# EAGLE design Fermento (EAGLE 6.5.0)
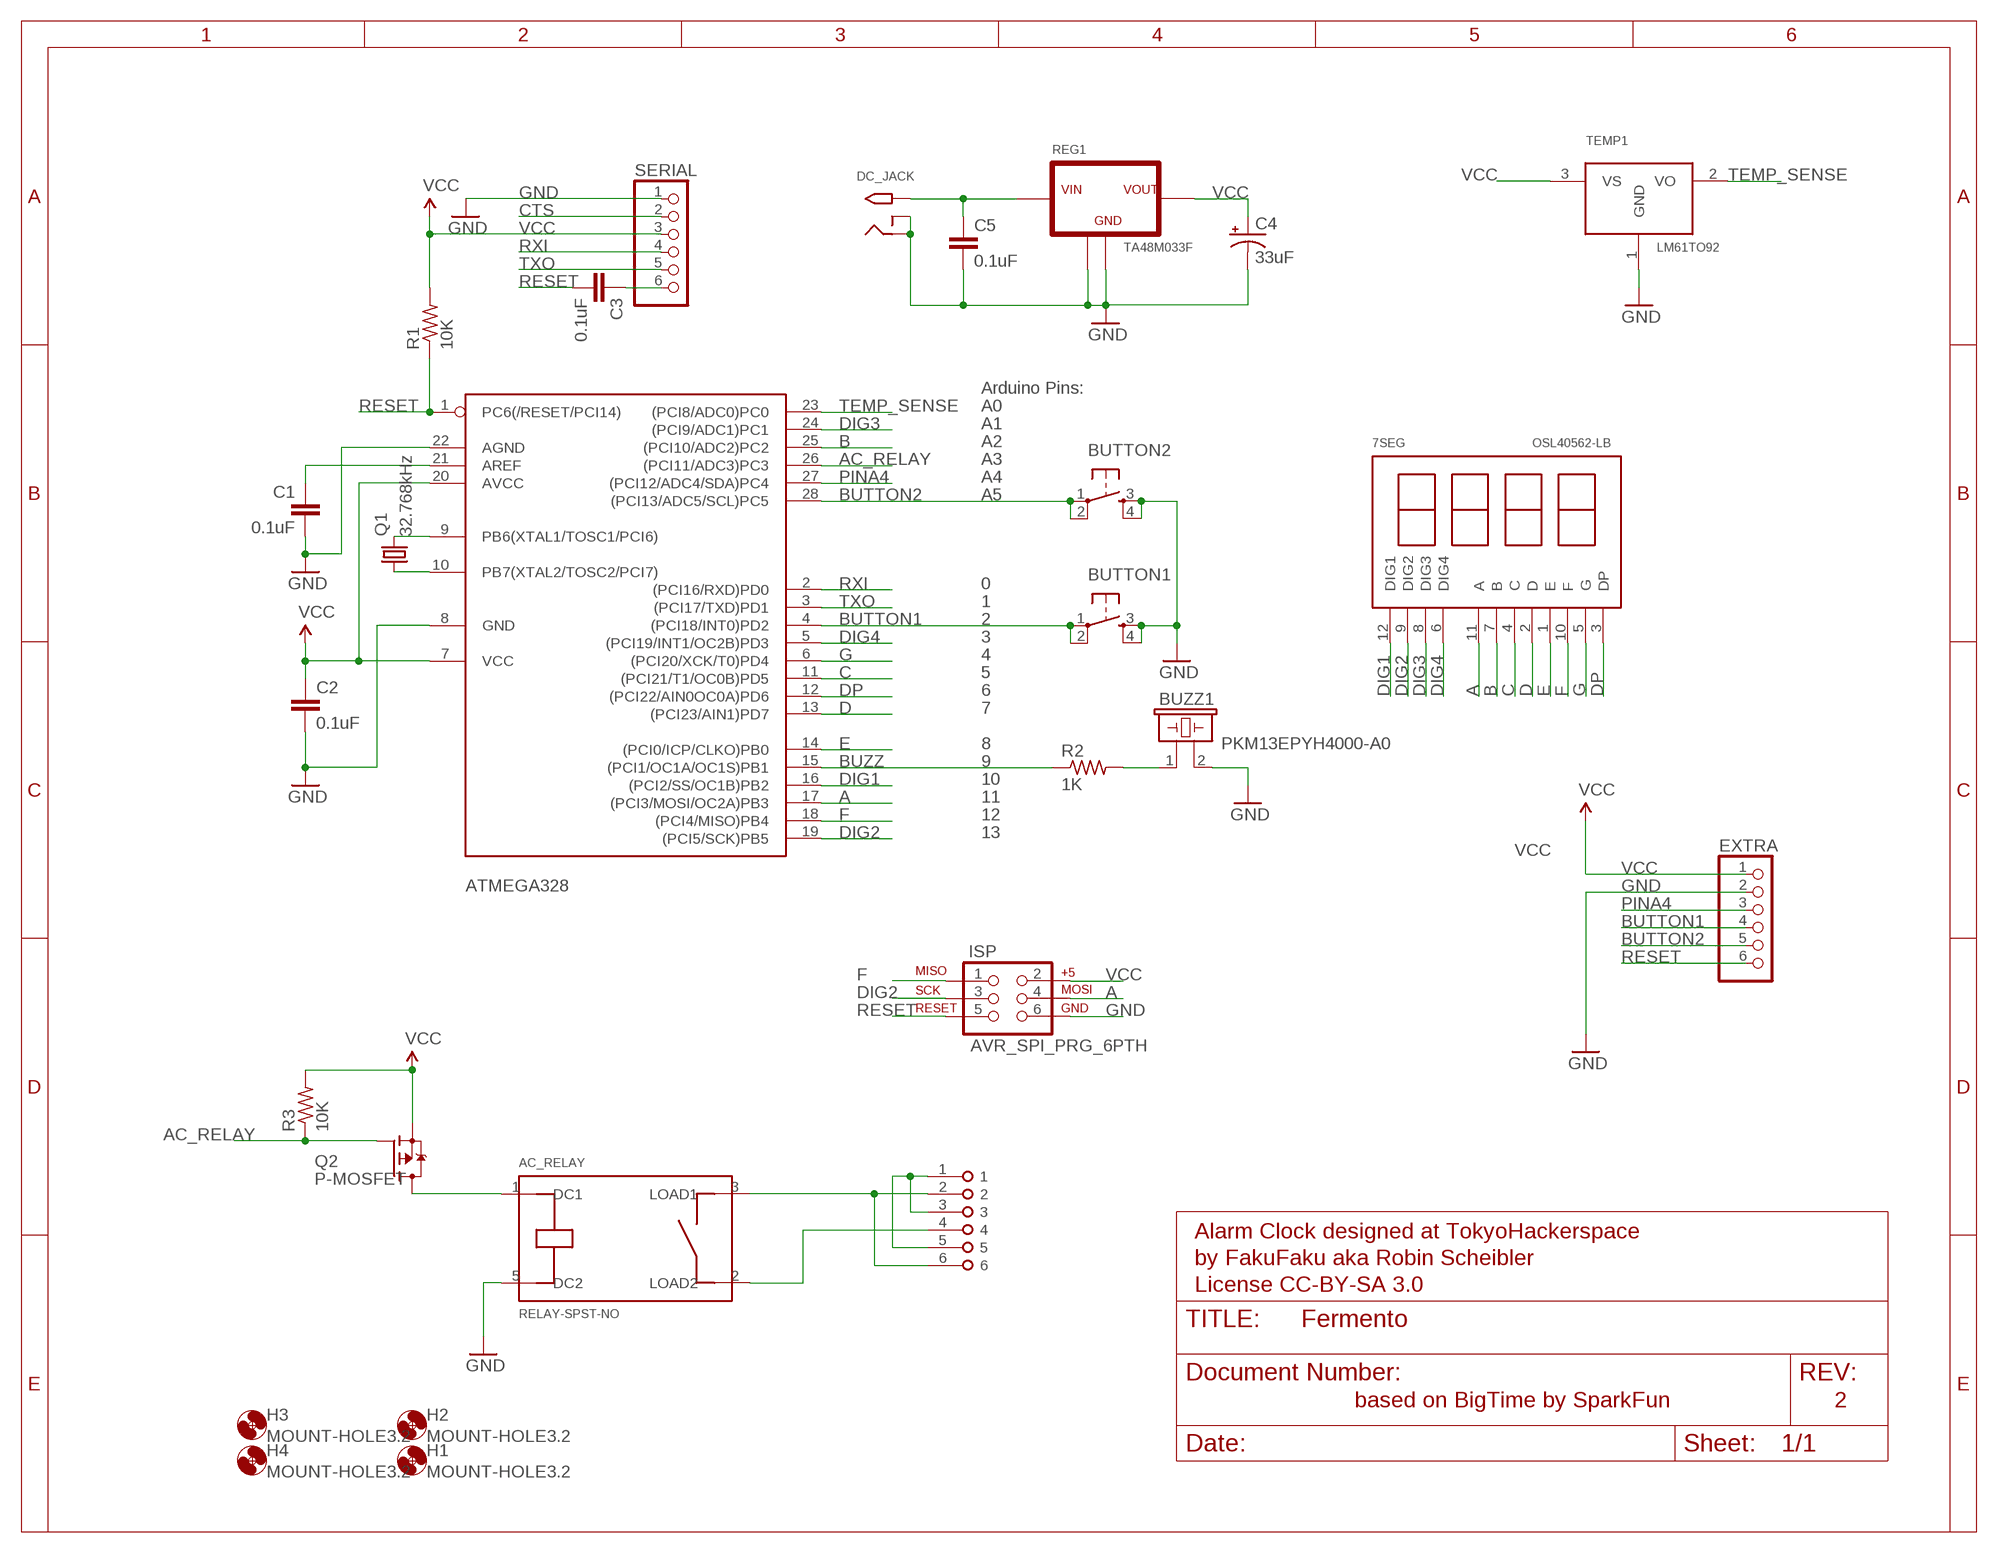
[diagram p0: schematic, sheet 1]

## Parts
7SEG  OSL40562-LB  7SEG  [OSL40562]
AC_RELAY  RELAY-SPST-NO  [G6RL-1A-DC3]
ATMEGA328  ATMEGA168-20P  [DIL28-3]
BUTTON1  TAC_SWITCHPTH  [TACTILE-PTH]
BUTTON2  TAC_SWITCHPTH  [TACTILE-PTH]
BUZZ1  PKM13EPYH4000-A0  BUZZER13MM  [PIEZO-MURATA-13MM]
C1  0.1uF  CAPPTH  [CAP-PTH-SMALL]
C2  0.1uF  CAPPTH  [CAP-PTH-SMALL]
C3  0.1uF  CAPPTH  [CAP-PTH-SMALL]
C4  33uF  CAP_POLPTH2  [CPOL-RADIAL-10UF-25V]
C5  0.1uF  CAPPTH  [CAP-PTH-SMALL]
DC_JACK  2.1MMJACKTHM  [PJ-102A]
EXTRA  PINHD-1X6  [1X06]
H1  MOUNT-HOLE3.2  [3,2]
H2  MOUNT-HOLE3.2  [3,2]
H3  MOUNT-HOLE3.2  [3,2]
H4  MOUNT-HOLE3.2  [3,2]
ISP  AVR_SPI_PRG_6PTH  [2X3]
Q1  32.768kHz  CRYSTAL8X3  [CRYSTAL-8X3-TH]
Q2  P-MOSFET  [TO92-]
R1  10K  R-US_0207/10  [0207/10]
R2  1K  R-US_0207/10  [0207/10]
R3  10K  R-US_0207/10  [0207/10]
REG1  TA48M033F  REGULATOR-TO-220  [TO-220]
SERIAL  PINHD-1X6/90  [1X06/90]
TEMP1  LM61TO92  [TO92-]
U$2  TERMINAL-6  [MBE-156]

## Nets
A: 7SEG.11(A) ATMEGA328.17((PCI3/MOSI/OC2A)PB3) ISP.4
AC_RELAY: ATMEGA328.26((PCI11/ADC3)PC3) Q2.2(G) R3.1
AREF: ATMEGA328.21(AREF) C1.1
B: 7SEG.7(B) ATMEGA328.25((PCI10/ADC2)PC2)
BUTTON1: ATMEGA328.4((PCI18/INT0)PD2) BUTTON1.1 BUTTON1.2 EXTRA.4
BUTTON2: ATMEGA328.28((PCI13/ADC5/SCL)PC5) BUTTON2.1 BUTTON2.2 EXTRA.5
BUZZ: ATMEGA328.15((PCI1/OC1A/OC1S)PB1) R2.1
C: 7SEG.4(C) ATMEGA328.11((PCI21/T1/OC0B)PD5)
CTS: SERIAL.2
D: 7SEG.2(D) ATMEGA328.13((PCI23/AIN1)PD7)
DIG1: 7SEG.12(DIG1) ATMEGA328.16((PCI2/SS/OC1B)PB2)
DIG2: 7SEG.9(DIG2) ATMEGA328.19((PCI5/SCK)PB5) ISP.3
DIG3: 7SEG.8(DIG3) ATMEGA328.24((PCI9/ADC1)PC1)
DIG4: 7SEG.6(DIG4) ATMEGA328.5((PCI19/INT1/OC2B)PD3)
DP: 7SEG.3(DP) ATMEGA328.12((PCI22/AIN0OC0A)PD6)
E: 7SEG.1(E) ATMEGA328.14((PCI0/ICP/CLKO)PB0)
F: 7SEG.10(F) ATMEGA328.18((PCI4/MISO)PB4) ISP.1
G: 7SEG.5(G) ATMEGA328.6((PCI20/XCK/T0)PD4)
GND: AC_RELAY.5(DC2) ATMEGA328.8(GND) ATMEGA328.22(AGND) BUTTON1.3 BUTTON1.4 BUTTON2.3 BUTTON2.4 BUZZ1.2 C1.2 C2.2 C4.2(-) C5.2 DC_JACK.RING DC_JACK.RING_SW EXTRA.2 ISP.6 REG1.CENTER(GND) REG1.THERMAL(GND) SERIAL.1 TEMP1.1(GND)
N$1: ATMEGA328.9(PB6(XTAL1/TOSC1/PCI6)) Q1.2
N$2: ATMEGA328.10(PB7(XTAL2/TOSC2/PCI7)) Q1.1
N$3: C5.1 DC_JACK.TIP REG1.LEFT(VIN)
N$5: U$2.1 U$2.3 U$2.5
N$6: AC_RELAY.3(LOAD1) U$2.2 U$2.6
N$7: C3.1 SERIAL.6
N$8: AC_RELAY.2(LOAD2) U$2.4
N$13: BUZZ1.1 R2.2
PINA4: ATMEGA328.27((PCI12/ADC4/SDA)PC4) EXTRA.3
RELAY: AC_RELAY.1(DC1) Q2.1(D)
RESET: ATMEGA328.1(PC6(/RESET/PCI14)) C3.2 EXTRA.6 ISP.5 R1.1
RXI: ATMEGA328.2((PCI16/RXD)PD0) SERIAL.4
TEMP_SENSE: ATMEGA328.23((PCI8/ADC0)PC0) TEMP1.2(VO)
TXO: ATMEGA328.3((PCI17/TXD)PD1) SERIAL.5
VCC: ATMEGA328.7(VCC) ATMEGA328.20(AVCC) C2.1 C4.1(+) EXTRA.1 ISP.2 Q2.3(S) R1.2 R3.2 REG1.RIGHT(VOUT) SERIAL.3 TEMP1.3(VS)

## Notes on the sheet
- Arduino Pins:
- A0
- A1
- A2
- A3
- A4
- A5
- 0
- 1
- 2
- 3
- 4
- 5
- 6
- 7
- 8
- 9
- 10
- 11
- 12
- 13
- Alarm Clock designed at TokyoHackerspace
- by FakuFaku aka Robin Scheibler
- License CC-BY-SA 3.0
- based on BigTime by SparkFun | 2

## Library data of the parts
7SEG = Robin:7SEG
AC_RELAY = Robin:RELAY-SPST-NO
ATMEGA328 = adafruit:ATMEGA168*P: MICROCONTROLLER 16 kBytes FLASH 1 kBytes SRAM 512 Bytes EEPROM USART 8-channel 10 bit ADC
BUTTON1 BUTTON2 = SparkFun:TAC_SWITCH: Momentary Switch Button commonly used for reset or general input. Spark Fun Electronics SKU : COM-00097
BUZZ1 = Robin:BUZZER: BUZZER Source: muRata
C1-C3 C5 = SparkFun:CAP: Capacitor Standard 0603 ceramic capacitor, and 0.1" leaded capacitor.
C4 = SparkFun:CAP_POL: Capacitor Polarized These are standard SMD and PTH capacitors. Normally 10uF, 47uF, and 100uF in electrolytic and tantalum varieties. Always verify the external diameter of the through hole cap, it varies with capacity, voltage, and manufacturer. The EIA devices should be standard.
DC_JACK = adafruit:2.1MMJACK: 2.1mm x 5.5mm THM DC jack with internal switch. Digikey part #PJ-102A, 4UCON part #05537 2.1mm x 5.5mm SMT DC jack with internal switch. Digikey part #PJ-002A-SMT, 4UCON part #03267 By microbuilder.eu & adafruit.com
EXTRA SERIAL = pinhead:PINHD-1X6: PIN HEADER
H1-H4 = holes:MOUNT-HOLE: MOUNTING HOLE with drill center marker
ISP = SparkFun:AVR_SPI_PRG_6: AVR ISP 6 Pin This is the reduced ISP connector for AVR programming. Common on Arduino. This footprint will take up less PCB space and can be used with a 10-pin to 6-pin adapter such as SKU: BOB-08508
Q1 = Robin:CRYSTAL
Q2 = Robin:P-MOSFET
R1-R3 = adafruit:R-US_: RESISTOR, American symbol
REG1 = Robin:REGULATOR
TEMP1 = Robin:LM61: The LM61 is a precision integrated-circuit temperature sensor that can sense a ?30°C to +100°C temperature range while operating from a single +2.7V supply. The LM61's output volt- age is linearly proportional to Celsius (Centigrade) tempera- ture (+10 mV/°C) and has a DC offset of +600 mV. The offset allows reading negative temperatures without the need for a negative supply. The nominal output voltage of the LM61 ranges from +300 mV to +1600 mV for a ?30°C to +100°C temperature range. The LM61 is calibrated to provide accu- racies of ±2.0°C at room temperature and ±3°C over the full ?25°C to +85°C temperature range.
U$2 = Robin:TERMINAL-6

## Board
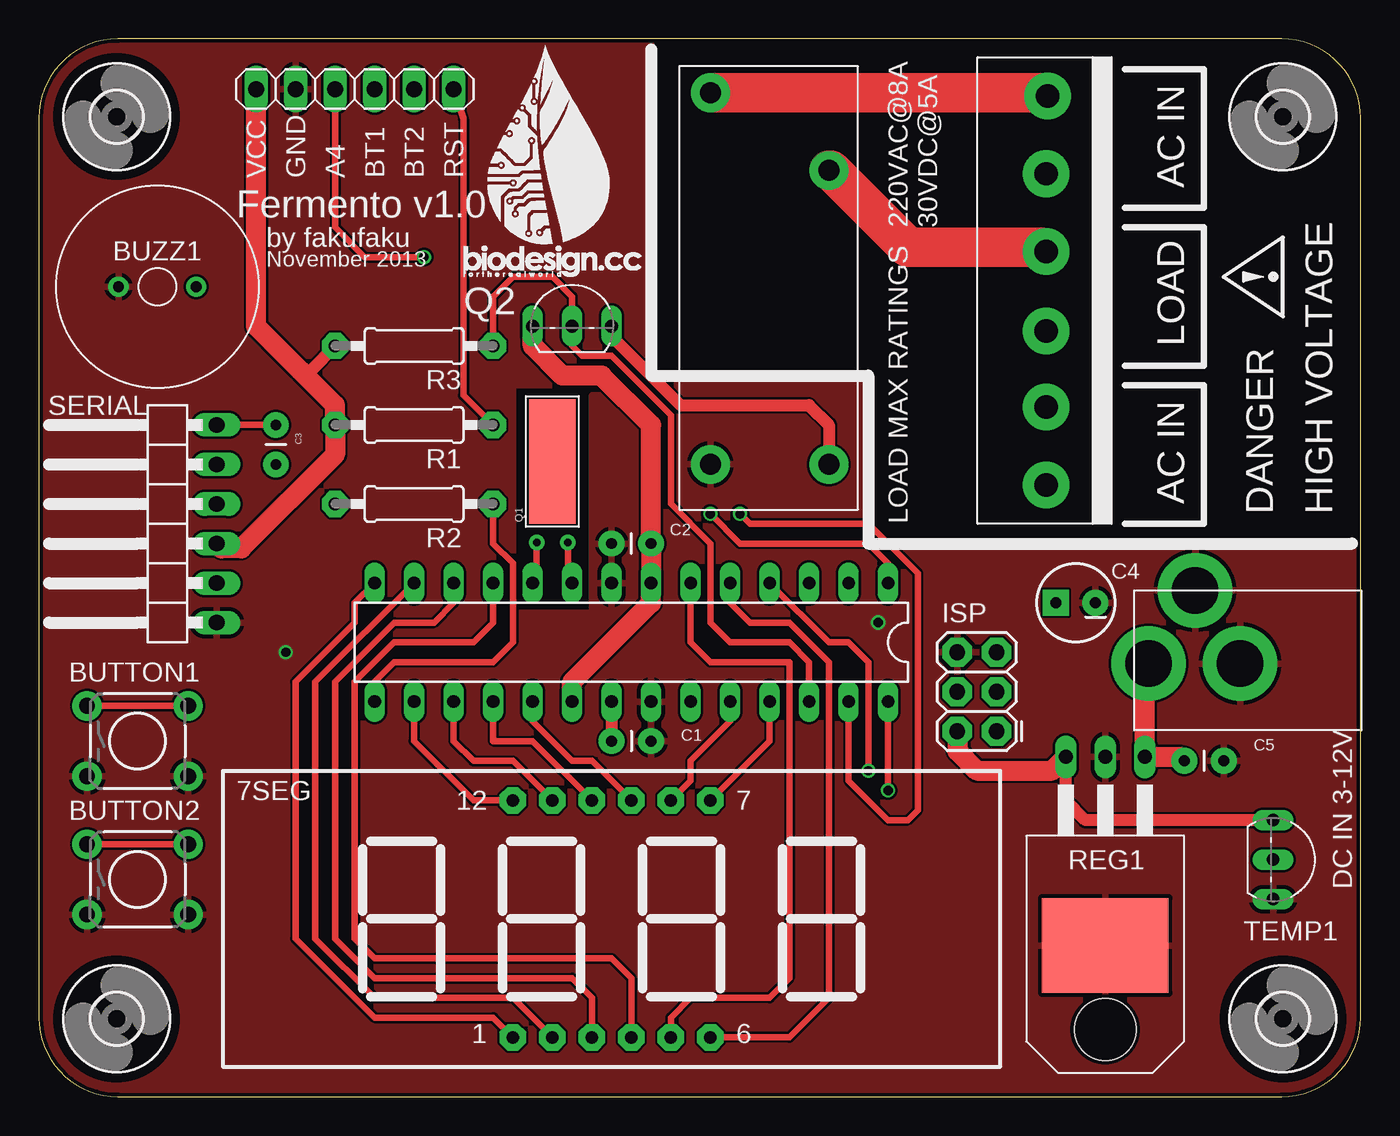
[diagram p1: board, top side]
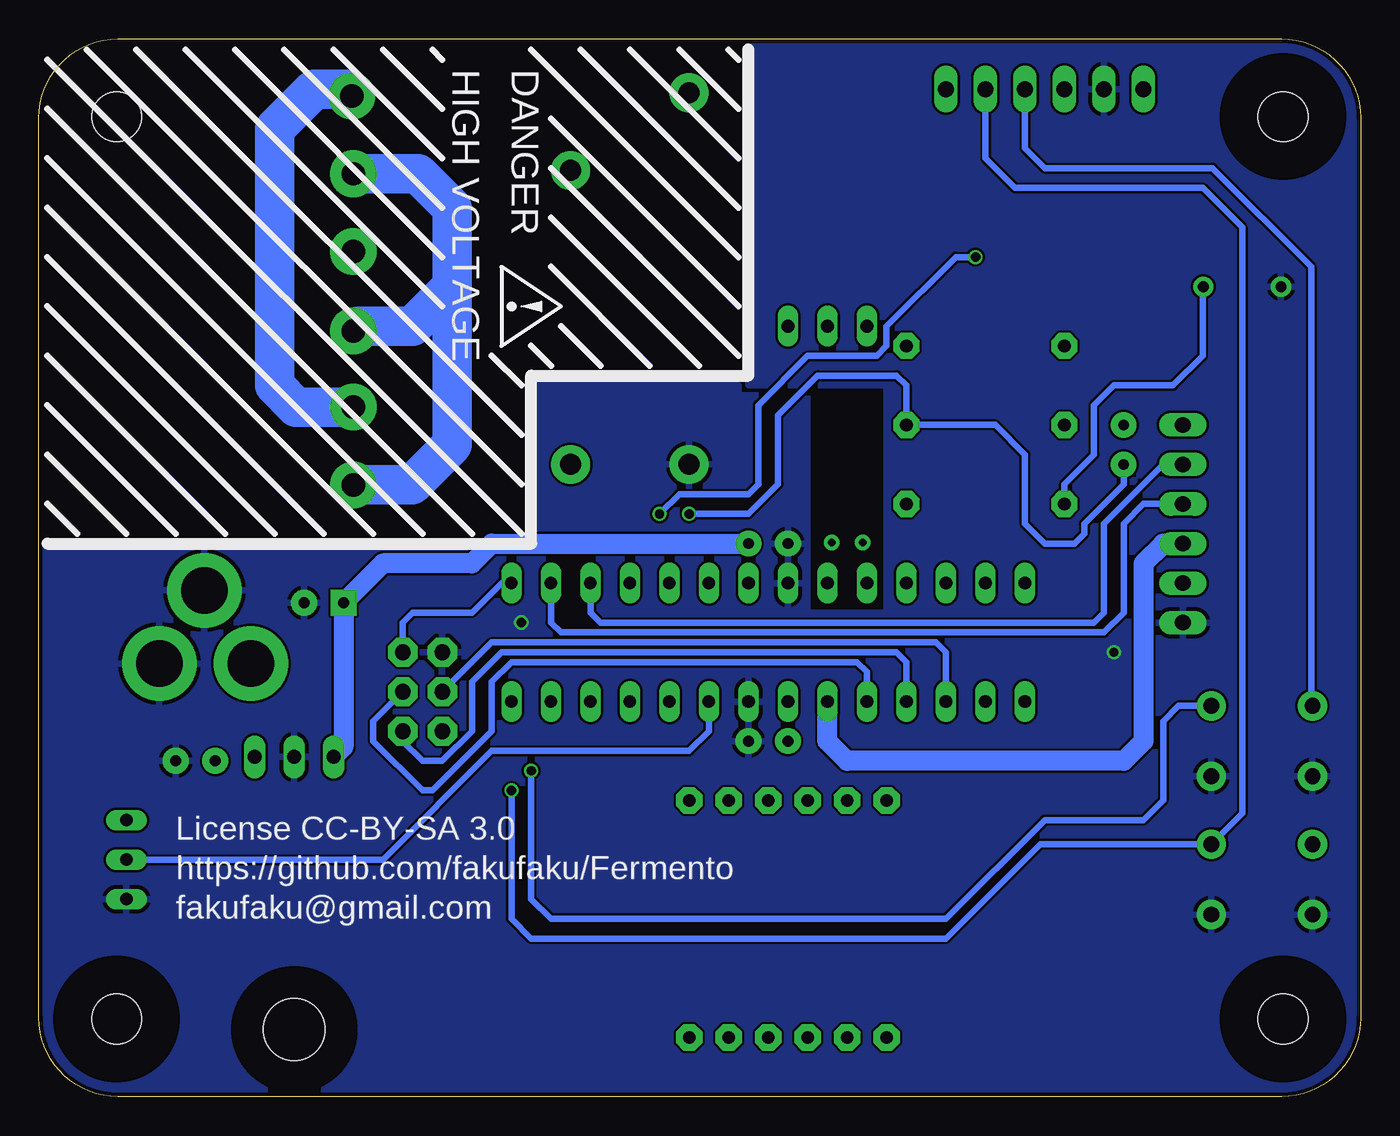
[diagram p2: board, bottom side, seen from below]

Size 85 x 68 mm. Coordinates in mm from the lower left corner, seen from the top.
Outline: 0,62.92 0,5.08 arc90 5.08,0 79.92,0 arc90 85,5.08 85,62.92 arc90 79.92,68 5.08,68 arc90 0,62.92
Copper layers (1*16): Top 0.035mm / dielectric 1.5mm / Bottom 0.035mm
Design rules "Fusion_eagle_rule_v1.1": minimum track width 6mil, minimum drill 12mil, track to track 6mil, track to pad 6mil, pad to pad 6mil, via to via 6mil, smd to smd 0mil, copper to edge 10mil, drill to drill 10mil, minimum pad ring 10mil, minimum via ring 6mil, stop-mask expansion 2mil, vias tented up to drill 100mil, thermal gap 10mil

### Footprints (pad centres in the part's own frame; a part is rotated, then mirrored left to right if it is on the bottom)
OSL40562 = drill 0.8 pad 1.7 octagon: 1 -6.35,-7.62; 2 -3.81,-7.62; 3 -1.27,-7.62; 4 1.27,-7.62; 5 3.81,-7.62; 6 6.35,-7.62; 7 6.35,7.62; 8 3.81,7.62; 9 1.27,7.62; 10 -1.27,7.62; 11 -3.81,7.62; 12 -6.35,7.62
G6RL-1A-DC3 = drill 1.35 pad 2.5: 1 0,-7.62; 2 18.9,-7.62; 3 23.9,0; 5 0,0
DIL28-3 = drill 0.813 long: 1 -16.51,-3.81; 2 -13.97,-3.81; 3 -11.43,-3.81; 4 -8.89,-3.81; 5 -6.35,-3.81; 6 -3.81,-3.81; 7 -1.27,-3.81; 8 1.27,-3.81; 9 3.81,-3.81; 10 6.35,-3.81; 11 8.89,-3.81; 12 11.43,-3.81; 13 13.97,-3.81; 14 16.51,-3.81; 15 16.51,3.81; 16 13.97,3.81; 17 11.43,3.81; 18 8.89,3.81; 19 6.35,3.81; 20 3.81,3.81; 21 1.27,3.81; 22 -1.27,3.81; 23 -3.81,3.81; 24 -6.35,3.81; 25 -8.89,3.81; 26 -11.43,3.81; 27 -13.97,3.81; 28 -16.51,3.81
TACTILE-PTH = drill 1.016 pad 1.88: 1 -3.251,2.261; 2 3.251,2.261; 3 -3.251,-2.261; 4 3.251,-2.261
PIEZO-MURATA-13MM = drill 0.7 pad 1.3: 1 -2.5,0; 2 2.5,0
CAP-PTH-SMALL = drill 0.7 pad 1.651: 1 0,0; 2 2.54,0
CPOL-RADIAL-10UF-25V = drill 0.7 pad 1.651 square: 1 1.27,0 | drill 0.7 pad 1.651: 2 -1.27,0
PJ-102A = drill 3 pad 4.8: RING 0.1,-3.39; RING_SW -4.6,-6.29; TIP 0.1,-9.29
1X06 = drill 1.016 long: 1 -6.35,0; 2 -3.81,0; 3 -1.27,0; 4 1.27,0; 5 3.81,0; 6 6.35,0
3,2 = hole 3.2: 0,0
2X3 = drill 1.016 pad 1.88 octagon: 1 0,0; 2 0,2.54; 3 2.54,0; 4 2.54,2.54; 5 5.08,0; 6 5.08,2.54
CRYSTAL-8X3-TH = drill 0.5 pad 0.8: 1 -1,-1.2; 2 1,-1.2 | smd 3 x 8: PLATE 0,4
TO92- = drill 0.813 long: 1 2.54,0; 2 0,0; 3 -2.54,0
0207/10 = drill 0.813 pad 1.676 octagon: 1 -5.08,0; 2 5.08,0
TO-220 = drill 0.889 long: CENTER 5.08,-5.08; LEFT 2.54,-5.08; RIGHT 7.62,-5.08 | smd 8.128 x 6.096: THERMAL 5.08,7.048 | hole 3.962: 5.08,12.446
1X06/90 = drill 1.016 long: 1 -6.35,-3.81; 2 -3.81,-3.81; 3 -1.27,-3.81; 4 1.27,-3.81; 5 3.81,-3.81; 6 6.35,-3.81
MBE-156 = drill 1.5 pad 3: 1 2.5,0; 2 7.5,0; 3 12.4,0; 4 17.5,0; 5 22.5,0; 6 27.5,-0.1

### Placement (x,y rotation side)
7SEG  36.83,11.43 0 top
AC_RELAY  43.18,40.64 90 top
ATMEGA328  38.1,29.21 180 top
BUTTON1  6.35,22.86 0 top
BUTTON2  6.35,13.97 0 top
BUZZ1  7.62,52.07 180 top
C1  36.83,22.86 0 top
C2  39.37,35.56 180 top
C3  15.24,43.18 270 top
C4  66.67,31.75 180 top
C5  73.66,21.59 0 top
DC_JACK  80.64,27.94 270 top
EXTRA  20.32,64.77 0 top
H1  5,63 0 top
H2  80,63 0 top
H3  80,5 0 top
H4  5,5 0 top
ISP  61.59,23.5 90 top
Q1  33.02,36.83 0 top
Q2  34.29,49.53 0 top
R1  24.13,43.18 180 top
R2  24.13,38.1 180 top
R3  24.13,48.26 180 top
REG1  73.66,16.76 180 top
SERIAL  7.62,36.83 90 top
TEMP1  79.38,15.24 270 top
U$1  [DANGER-SMALL]  78.74,52.7 90 top
U$2  64.77,36.83 90 top
U$3  [DANGER-SMALL]  53.98,50.8 270 bottom
U$4  [BIODESIGN-LOGO]  27.3,52.7 0 top

### Tracks (layer width: path | path; a pad name or v marks a point on that pad's centre or on a via)
A
  Top 0.406: ATMEGA328.17 26.67,22.86 27.94,21.59 30.48,21.59 7SEG.11
  Bottom 0.406: ATMEGA328.17 26.67,28.57 27.3,29.21 55.88,29.21 ISP.4
AC_RELAY
  Top 0.406: ATMEGA328.26 49.53,27.94 48.26,29.21 44.45,29.21 43.18,30.48 43.18,35.56 40.64,38.1 40.64,43.81 36.83,47.62 34.92,47.62 34.29,48.26 Q2.2 34.29,51.44 33.02,52.7 30.48,52.7 29.21,51.44 R3.1
AREF
  Top 0.762: ATMEGA328.21 C1.1
B
  Top 0.406: ATMEGA328.25 46.99,22.86 7SEG.7
BUTTON1  (via drill 0.6)
  Top 0.406: BUTTON1.1 BUTTON1.2 | ATMEGA328.4 50.8,29.21 52.07,29.21 53.34,27.94 v53.34,20.95
  Bottom 0.406: BUTTON1.2 11.71,25.12 12.7,24.13 12.7,19.05 13.97,17.78 20.32,17.78 26.67,11.43 52.07,11.43 53.34,12.7 v53.34,20.95 | EXTRA.4 21.59,60.96 20.32,59.69 9.53,59.69 3.17,53.34 3.17,25.2 BUTTON1.1
BUTTON2  (via drill 0.6)
  Top 0.406: BUTTON2.1 BUTTON2.2 | v54.61,19.68 ATMEGA328.28
  Bottom 0.406: v54.61,19.68 54.61,11.43 53.34,10.16 26.67,10.16 20.6,16.23 BUTTON2.2 7.62,18.21 7.62,55.88 10.16,58.42 22.23,58.42 24.13,60.33 EXTRA.5
BUZZ
  Top 0.406: R2.1 29.21,35.56 30.48,34.29 30.48,29.21 29.21,27.94 22.86,27.94 21.59,26.67 ATMEGA328.15
C
  Top 0.406: 7SEG.4 38.1,7.62 36.83,8.89 21.59,8.89 20.32,10.16 20.32,26.67 22.86,29.21 27.94,29.21 29.21,30.48 ATMEGA328.11
D
  Top 0.406: ATMEGA328.13 17.78,26.67 17.78,10.16 21.59,6.35 30.48,6.35 7SEG.2
DIG1
  Top 0.406: ATMEGA328.16 24.13,22.86 27.94,19.05 7SEG.12
DIG2
  Top 0.406: ATMEGA328.19 31.75,24.13 34.29,21.59 35.56,21.59 7SEG.9
  Bottom 0.406: ISP.3 63.5,24.13 63.5,22.86 60.33,19.68 59.69,19.68 55.88,23.5 55.88,26.67 54.61,27.94 32.38,27.94 31.75,27.3 ATMEGA328.19
DIG3
  Top 0.406: ATMEGA328.24 44.45,24.13 41.91,21.59 41.91,20.32 7SEG.8
DIG4
  Top 0.406: 7SEG.6 48.26,3.81 50.8,6.35 50.8,27.94 48.26,30.48 45.72,30.48 44.45,31.75 ATMEGA328.5
DP
  Top 0.406: 7SEG.3 35.56,6.35 34.29,7.62 21.59,7.62 19.05,10.16 19.05,26.67 22.86,30.48 25.4,30.48 26.67,31.75 ATMEGA328.12
E
  Top 0.406: ATMEGA328.14 20.32,31.75 20.32,30.48 16.51,26.67 16.51,10.16 21.59,5.08 29.21,5.08 7SEG.1
F
  Top 0.406: ATMEGA328.18 29.21,22.86 31.75,22.86 7SEG.10
  Bottom 0.406: ISP.1 61.59,22.86 60.33,21.59 59.05,21.59 57.15,23.5 57.15,26.67 55.24,28.57 29.84,28.57 29.21,27.94 ATMEGA328.18
G
  Top 0.406: 41.91,31.75 ATMEGA328.6 41.91,29.21 43.18,27.94 48.26,27.94 48.26,7.62 46.99,6.35 41.91,6.35 40.64,5.08 7SEG.5
GND  (via drill 0.6)
  other vias: 15.88,28.57 53.98,30.48
  pour Bottom: 39.37,73.66 -1.27,73.66 -1.27,-1.27 88.9,-1.27 88.9,35.56 53.34,35.56 53.34,45.72 40.01,45.72 40.01,45.09 35.56,45.09 35.56,31.11 30.48,31.11 30.48,45.72 39.37,45.72
  pour Top: -2.54,-1.27 -2.54,69.85 39.37,69.85 39.37,45.72 30.48,45.72 30.48,31.11 35.56,31.11 35.56,45.09 40.01,45.09 40.01,45.72 53.34,45.72 53.34,35.56 86.36,35.56 86.36,-1.27
N$1
  Top 0.406: Q1.2 34.02,33.29 ATMEGA328.9
N$2
  Top 0.406: Q1.1 32.02,33.29 ATMEGA328.10
N$3
  Top 1.27: DC_JACK.TIP 71.12,27.61 REG1.LEFT 73.41,21.84 C5.1
N$5
  Bottom 2.54: U$2.5 60.6,59.33 58.42,57.15 58.42,52.07 | 58.42,52.07 60.96,49.53 64.47,49.53 U$2.3 | U$2.1 61,39.33 58.42,41.91 58.42,52.07
N$6
  Top 2.54: AC_RELAY.3 64.66,64.54 U$2.6
  Bottom 2.54: U$2.2 68.46,44.33 69.85,45.72 69.85,62.23 67.31,64.77 65.31,64.77 U$2.6
N$7
  Top 0.406: SERIAL.6 C3.1
N$8
  Top 2.54: AC_RELAY.2 50.95,59.54 55.88,54.61 64.49,54.61 U$2.4
N$13
  Bottom 0.406: R2.2 19.05,39.37 17.14,41.27 17.14,44.45 15.88,45.72 12.06,45.72 10.16,47.62 10.16,52.03 BUZZ1.1
PINA4  (via drill 0.6)
  Top 0.406: ATMEGA328.27 52.07,20.32 54.61,17.78 55.88,17.78 56.52,18.41 56.52,33.66 53.34,36.83 45.72,36.83 v45.09,37.47 | EXTRA.3 19.05,55.88 20.95,53.98 v24.77,53.98
  Bottom 0.406: v45.09,37.47 43.81,38.73 39.37,38.73 38.73,39.37 38.73,44.45 35.56,47.62 31.11,47.62 30.48,48.26 30.48,49.53 26.04,53.98 v24.77,53.98
RELAY
  Top 0.762: AC_RELAY.1 50.8,43.18 49.53,44.45 41.27,44.45 36.83,48.9 Q2.1
RESET  (via drill 0.6)
  Top 0.406: ATMEGA328.1 54.61,34.29 53.34,35.56 45.09,35.56 v43.18,37.47 | EXTRA.6 27.3,62.87 27.3,45.09 R1.1
  Bottom 0.406: C3.2 15.24,39.37 17.78,36.83 17.78,36.2 18.41,35.56 20.32,35.56 21.59,36.83 21.59,41.27 23.5,43.18 R1.1 29.21,45.72 29.84,46.35 34.92,46.35 37.47,43.81 37.47,39.37 39.37,37.47 v43.18,37.47 | ATMEGA328.1 55.24,33.02 57.15,31.11 60.96,31.11 61.59,30.48 ISP.5
RXI
  Bottom 0.406: SERIAL.4 13.97,38.1 15.24,36.83 15.24,31.11 16.51,29.84 51.44,29.84 52.07,30.48 ATMEGA328.2
TEMP_SENSE
  Bottom 0.406: TEMP1.2 62.87,15.24 55.88,22.23 43.18,22.23 41.91,23.5 ATMEGA328.23
TXO
  Bottom 0.406: SERIAL.5 12.7,40.64 16.51,36.83 16.51,31.11 17.14,30.48 48.9,30.48 49.53,31.11 ATMEGA328.3
VCC
  Top 0.762: TEMP1.3 67.31,17.78 66.04,19.05 REG1.RIGHT | R3.2 17.46,46.67 16.83,46.67
  Top 1.27: ATMEGA328.20 34.29,26.67 39.37,31.75 ATMEGA328.7 C2.1 39.37,43.18 36.2,46.35 33.66,46.35 31.75,48.26 Q2.3 | SERIAL.3 11.75,35.24 13.02,35.24 19.05,41.27 R1.2 19.05,44.45 16.83,46.67 13.97,49.53 EXTRA.1 | ISP.2 59.05,22.23 60.33,20.95 65.15,20.95 REG1.RIGHT
  Bottom 1.27: C2.1 55.88,35.56 57.15,34.29 62.87,34.29 C4.1 65.41,22.48 REG1.RIGHT | SERIAL.3 12.7,35.56 13.97,34.29 13.97,22.86 15.24,21.59 33.02,21.59 34.29,22.86 ATMEGA328.20

### Text on the board
tPlace: VCC | GND | A4 | BT1 | BT2 | RST | AC IN | Fermento v1.0 | 220VAC@8A | 30VDC@5A | by fakufaku | November 2013 | LOAD | AC IN | LOAD MAX RATINGS | DANGER | HIGH VOLTAGE | DC IN 3-12V
bPlace: DANGER | HIGH VOLTAGE | License CC-BY-SA 3.0 | https://github.com/fakufaku/Fermento | fakufaku@gmail.com